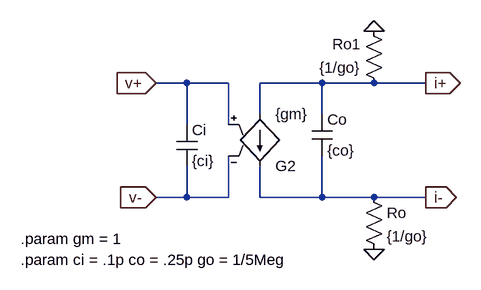
[diagram p0: schematic OTA_diff.asc]
OTA_diff.asc, the LTspice schematic file:
Version 4
SHEET 1 880 680
WIRE -16 80 -64 80
WIRE 48 80 -16 80
WIRE 192 80 96 80
WIRE 272 80 192 80
WIRE 352 80 272 80
WIRE 96 128 96 80
WIRE 192 128 192 80
WIRE -16 144 -16 80
WIRE 48 144 48 80
WIRE -16 256 -16 208
WIRE -16 256 -64 256
WIRE 48 256 48 192
WIRE 48 256 -16 256
WIRE 96 256 96 208
WIRE 192 256 192 192
WIRE 192 256 96 256
WIRE 272 256 192 256
WIRE 352 256 272 256
FLAG 352 80 i+
IOPIN 352 80 Out
FLAG 352 256 i-
IOPIN 352 256 Out
FLAG -64 80 v+
IOPIN -64 80 In
FLAG -64 256 v-
IOPIN -64 256 In
FLAG 272 336 0
FLAG 272 0 0
SYMBOL cap -32 144 R0
SYMATTR InstName Ci
SYMATTR Value {ci}
SYMBOL cap 176 128 R0
SYMATTR InstName Co
SYMATTR Value {co}
SYMBOL res 256 240 R0
SYMATTR InstName Ro
SYMATTR Value {1/go}
SYMBOL g2 96 224 M180
SYMATTR InstName G2
SYMATTR Value {gm}
SYMBOL res 288 96 R180
WINDOW 0 36 76 Left 2
WINDOW 3 36 40 Left 2
SYMATTR InstName Ro1
SYMATTR Value {1/go}
TEXT -272 320 Left 2 !.param gm = 1
TEXT -272 352 Left 2 !.param ci = .1p co = .25p go = 1/5Meg

The netlist it stands for:
* OTA_diff.asc
Ci v+ v- {ci}
Co i+ i- {co}
Ro i- 0 {1/go}
G2 i+ i- v+ v- {gm}
Ro1 i+ 0 {1/go}
.param gm = 1
.param ci = .1p co = .25p go = 1/5Meg
.backanno
.end